# EAGLE design ShrewSpecs-1-2 (EAGLE 9.6.2)
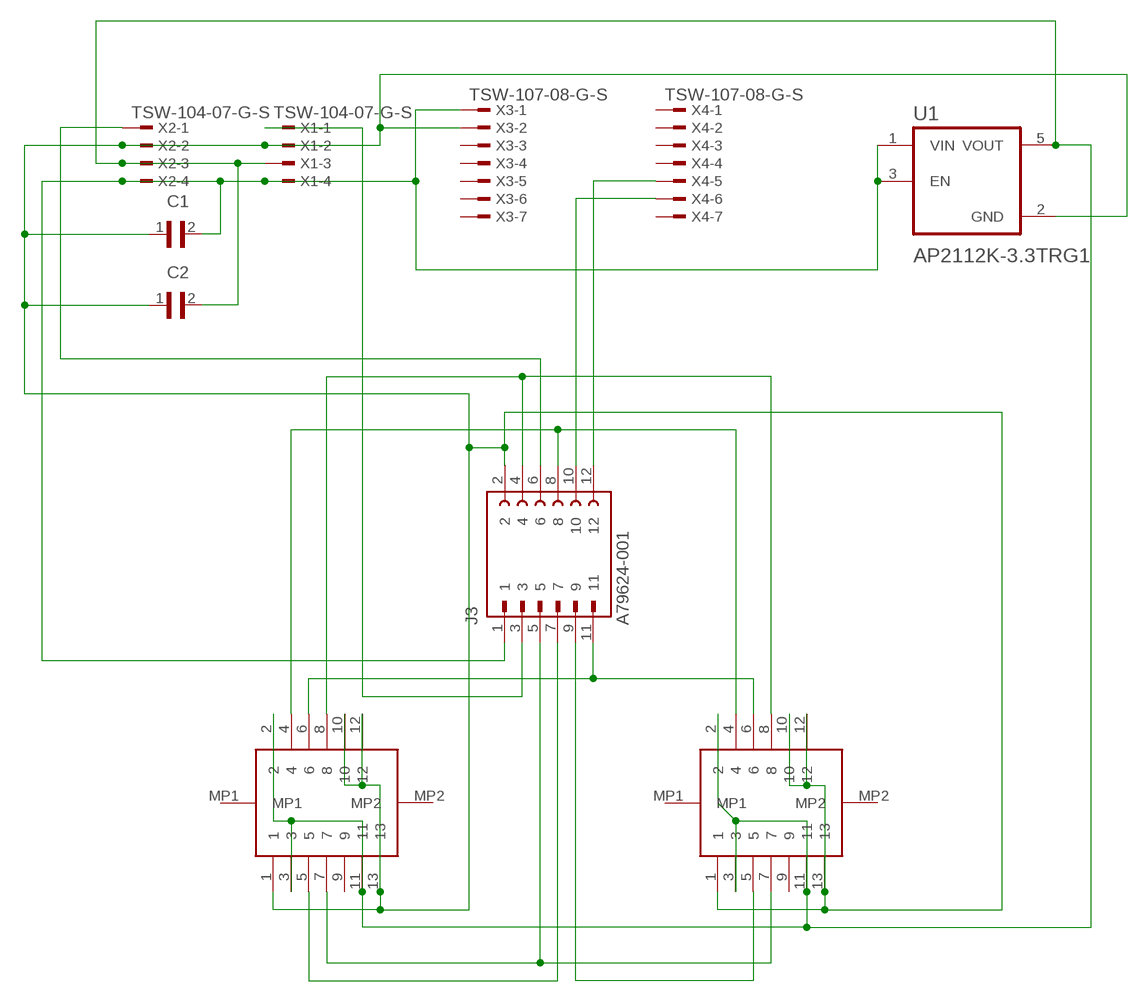
[diagram p0: schematic, sheet 1]

## Parts
C1  CL21A106KOQNNNE  [CAPC2012X140N]
C2  CL21A106KOQNNNE  [CAPC2012X140N]
J1  1-2328724-3  [123287243]
J2  1-2328724-3  [123287243]
J3  A79624-001  [OMNETICS_A79624-001]
U1  AP2112K-3.3TRG1  [SOT95P285X140-5N]
X1  TSW-104-07-G-S  [TSW-104-XX-G-S]
X2  TSW-104-07-G-S  [TSW-104-XX-G-S]
X3  TSW-107-08-G-S  [TSW-107-XX-G-S]
X4  TSW-107-08-G-S  [TSW-107-XX-G-S]

## Nets
N$1: C1.2 J3.1 U1.1(VIN) U1.3(EN) X1.4 X2.4 X3.1
N$2: J3.6 X2.1
N$3: C1.1 C2.1 J1.1 J1.10 J1.12 J1.13 J2.1 J2.10 J2.12 J2.13 J3.2 U1.2(GND) X1.2 X2.2 X3.2
N$4: J1.7 J2.7 J3.5
N$5: J1.5 J3.7
N$6: J2.5 J3.9
N$7: J1.6 J2.6 J3.11
N$8: J1.8 J2.8 J3.4
N$9: J1.4 J2.4 J3.8
N$10: J3.3 X1.1
N$11: J3.12 X4.5
N$12: J3.10 X4.6
N$14: C2.2 J1.2 J1.3 J1.11 J2.2 J2.3 J2.11 U1.5(VOUT) X1.3 X2.3
Unconnected: J1.9 J1.MP1 J1.MP2 J2.9 J2.MP1 J2.MP2 X3.3 X3.4 X3.5 X3.6 X3.7 X4.1 X4.2 X4.3 X4.4 X4.7

## Library data of the parts
C1 C2 = CL21A106KOQNNNE:CL21A106KOQNNNE; A_MAX: 1.4; A_MIN: 1.4; A_NOM: 1.4; D_MAX: 2.15; D_MIN: 1.85; D_NOM: 2.0; E_MAX: 1.4; E_MIN: 1.1; E_NOM: 1.25; L1_MAX: 0.7; L1_MIN: 0.2; L1_NOM: 0.5; L_MAX: 0.7; L_MIN: 0.2; L_NOM: 0.5; MANUFACTURER: Samsung Electro-Mechanics; STANDARD: IPC 7351B
J1 J2 = 1-2328724-3:1-2328724-3: AMP - TE CONNECTIVITY - 1-2328724-3 - CONNECTOR, FPC, R/A, 13POS, 1ROW, 0.3MM Source: Datasheet <https://www.te.com/commerce/DocumentDelivery/DDEController?Action=showdoc&DocId=Customer Drawing23287243pdfEnglishENG_CD_2328724_3.pdf1-2328724-3>; DESCRIPTION: AMP - TE CONNECTIVITY - 1-2328724-3 - CONNECTOR, FPC, R/A, 13POS, 1ROW, 0.3MM; HEIGHT: 1.1mm; MANUFACTURER_NAME: TE Connectivity; MANUFACTURER_PART_NUMBER: 1-2328724-3; MOUSER_PART_NUMBER: 571-1-2328724-3; MOUSER_PRICE-STOCK: https://www.mouser.co.uk/ProductDetail/TE-Connectivity/1-2328724-3?qs=w%2Fv1CP2dgqo8aBCjMy0R7g%3D%3D
J3 = A79624-001:A79624-001; CREATOR: DIZAR; MANUFACTURER: Omnetics; MAXIMUM_PACKAGE_HEIGHT: 4.826mm; PARTREV: E; STANDARD: Manufacturer Recommendations
U1 = AP2112K-3.3TRG1:AP2112K-3.3TRG1; MANUFACTURER: Diodes Inc.; PARTREV: 2-2
X1 X2 = con-samtec:TSW-104-*-G-S: THROUGH-HOLE .025" SQ POST HEADER Source: Samtec TSW.pdf; MF: Samtec Inc.; MPN: TSW-104-07-G-S
X3 X4 = con-samtec:TSW-107-*-G-S: THROUGH-HOLE .025" SQ POST HEADER Source: Samtec TSW.pdf; MF: Samtec Inc.; MPN: TSW-107-07-G-S

## Board
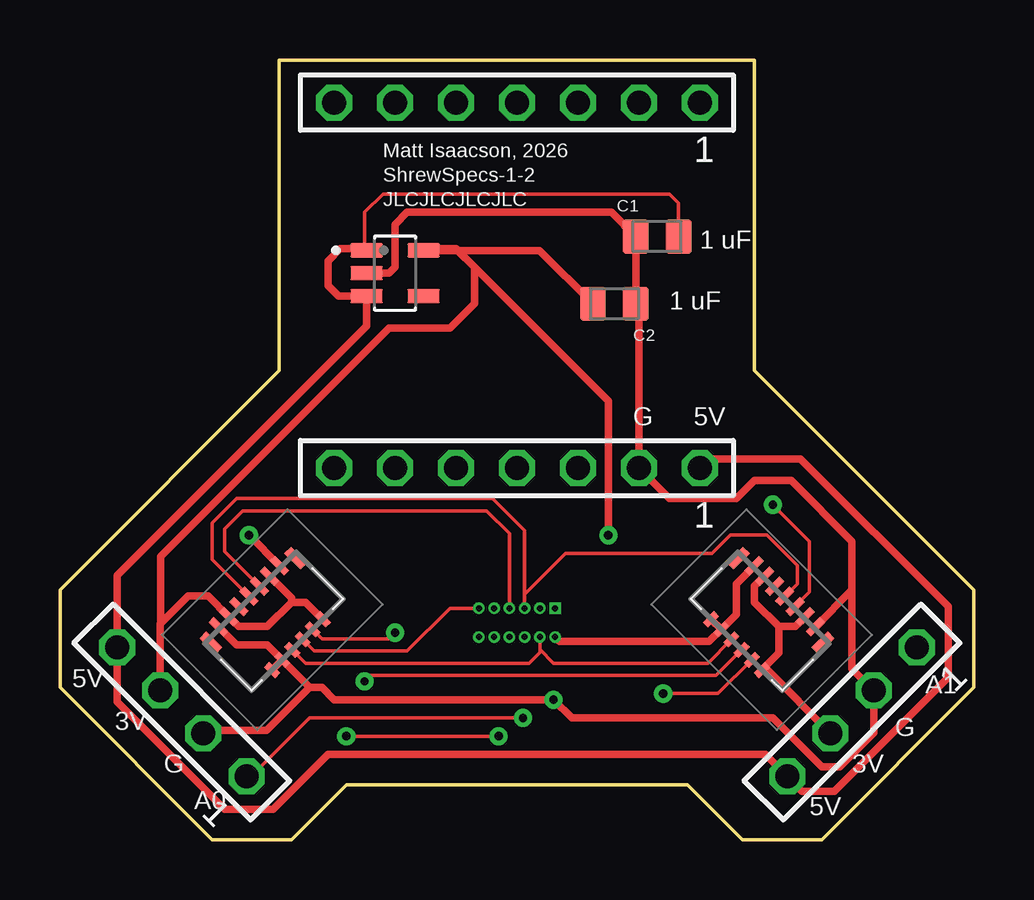
[diagram p1: board, top side]
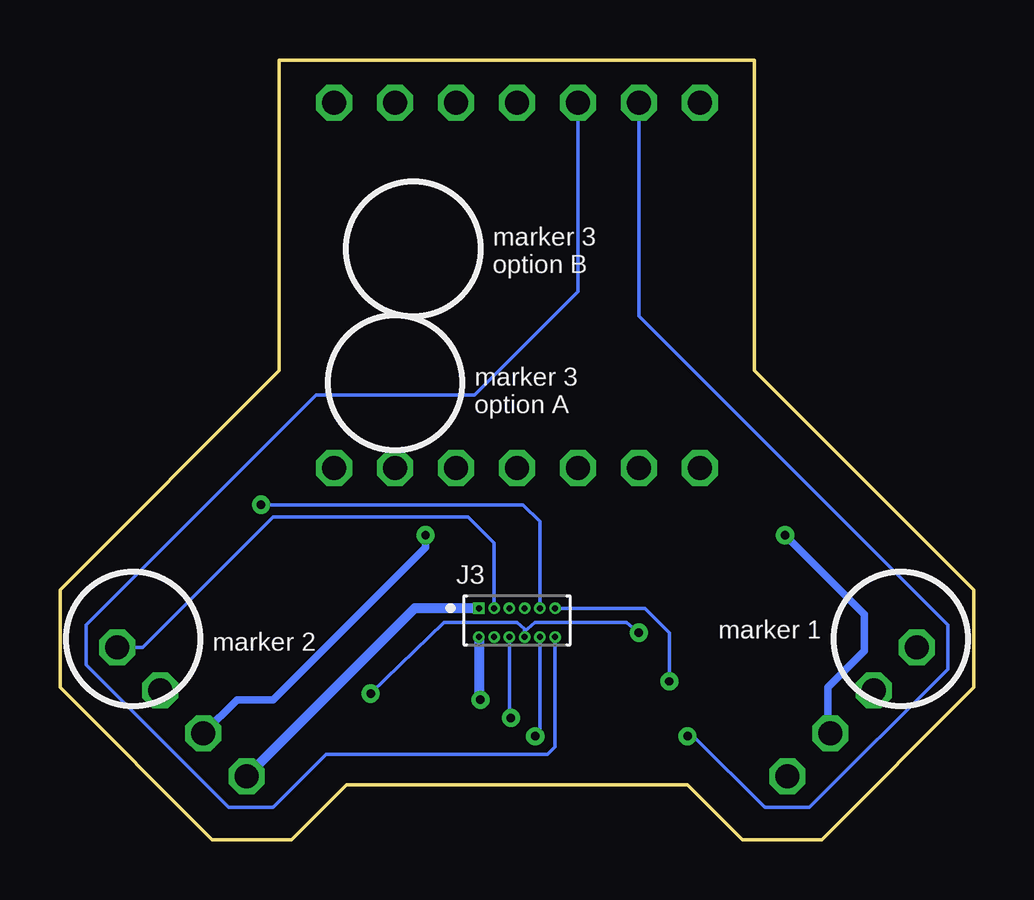
[diagram p2: board, bottom side, seen from below]

Size 38.1 x 32.51 mm. Coordinates in mm from the lower left corner, seen from the top.
Outline: 0,6.35 6.35,0 9.65,0 11.94,2.29 26.16,2.29 28.45,0 31.75,0 38.1,6.35 38.1,10.41 28.96,19.56 28.96,32.51 9.14,32.51 9.14,19.56 0,10.41 0,6.35
Copper layers (1*16): Top 0.035mm / dielectric 1.5mm / Bottom 0.035mm
Design rules "default *": minimum track width 6mil, minimum drill 0.25mm, track to track 6mil, track to pad 6mil, pad to pad 6mil, via to via 6mil, smd to smd 6mil, copper to edge 40mil, drill to drill 6mil, minimum pad ring 2mil, minimum via ring 8mil, stop-mask expansion 4mil, vias tented up to drill 0mil, thermal gap 10mil

### Footprints (pad centres in the part's own frame; a part is rotated, then mirrored left to right if it is on the bottom)
CAPC2012X140N = smd 1.08 x 1.42: 1 -0.895,0; 2 0.895,0
123287243 = smd 0.3 x 0.85: 1 -1.8,-1.425; 3 -1.2,-1.425; 5 -0.6,-1.425; 7 0,-1.425; 9 0.6,-1.425; 11 1.2,-1.425; 13 1.8,-1.425 | smd 0.3 x 0.65: 2 -1.5,1.425; 4 -0.9,1.425; 6 -0.3,1.425; 8 0.3,1.425; 10 0.9,1.425; 12 1.5,1.425 | smd 0.4 x 0.95: MP1 -2.5,-1.175; MP2 2.5,-1.175
OMNETICS_A79624-001 = drill 0.25 pad 0.483 square: 1 -1.587,0.508 | drill 0.25 pad 0.483: 2 -1.587,-0.686; 3 -0.953,0.508; 4 -0.953,-0.686; 5 -0.318,0.508; 6 -0.318,-0.686; 7 0.318,0.508; 8 0.318,-0.686; 9 0.953,0.508; 10 0.953,-0.686; 11 1.587,0.508; 12 1.587,-0.686
SOT95P285X140-5N = smd 1.35 x 0.6: 1 -1.185,0.95; 2 -1.185,0; 3 -1.185,-0.95; 4 1.185,-0.95; 5 1.185,0.95
TSW-104-XX-G-S = drill 1 pad 1.5 octagon: 1 3.81,0; 2 1.27,0; 3 -1.27,0; 4 -3.81,0
TSW-107-XX-G-S = drill 1 pad 1.5 octagon: 1 7.62,0; 2 5.08,0; 3 2.54,0; 4 0,0; 5 -2.54,0; 6 -5.08,0; 7 -7.62,0

### Placement (x,y rotation side)
C1  24.89,25.15 0 top
C2  23.11,22.35 180 top
J1  8.89,9.14 225 top
J2  29.21,9.14 135 top
J3  19.05,9.14 0 bottom
U1  13.97,23.62 0 top
X1  33.02,5.33 45 top
X2  5.08,5.33 315 top
X3  19.05,15.49 0 top
X4  19.05,30.73 0 top

### Tracks (layer width: path | path; a pad name or v marks a point on that pad's centre or on a via)
N$1
  Top 0.152: C1.2 25.79,26.54 25.4,26.92 13.46,26.92 12.7,26.16 12.7,24.66 12.72,24.64
  Top 0.305: U1.1 12.72,24.64 11.68,24.64 11.18,24.13 11.18,23.11 11.62,22.67 U1.3 12.79,21.42 2.39,11.02 X2.4 2.39,5.74 6.86,1.27 8.89,1.27 11.18,3.56 29.41,3.56 X1.4 30.93,2.03 32.28,2.03 37.02,6.78 37.02,9.73 30.87,15.88 27.06,15.88 X3.1
  Bottom 0.406: J3.1 23.31,9.65 X1.4
N$2  (via drill 0.35)
  Top 0.152: v19.3,5.08 10.41,5.08 7.97,2.64 X2.1
  Bottom 0.152: J3.6 19.37,5.14 v19.3,5.08
N$3  (via drill 0.35)
  Top 0.152: J1.10
  Top 0.305: J1.12 J1.10 10.41,6.35 | J1.13 7.36,8.13 8.64,8.13 J1.10 | X2.2 6.11,4.56 8.62,4.56 10.41,6.35 | J1.1 v7.88,12.7 v7.87,12.7 | J2.10 28.19,9.4 28.19,10.67 J2.13 | J2.10 J2.12 | J2.10 27.06,8.26 20.83,8.26 J3.2 | 33.02,10.41 33.02,12.45 30.48,14.99 28.96,14.99 28.19,14.22 25.4,14.22 X3.2 24.13,22.23 C2.1 C1.1 22.98,26.16 14.48,26.16 13.97,25.65 13.97,23.88 13.72,23.62 U1.2 | 33.02,10.41 J2.1 | 33.02,10.41 33.02,7.13 X1.2 33.92,4.45 32.51,3.05 31.75,3.05 29.72,5.08 21.34,5.08 v20.57,5.84 11.43,5.84 10.92,6.35 10.41,6.35
  Bottom 0.152: 6.1,4.55 X2.2 | 20.64,5.91 v20.57,5.84
  Bottom 0.305: v7.87,12.7 4.57,9.4 4.57,7.87 6.1,6.35 6.1,4.55
  Bottom 0.406: J3.2 20.64,5.91
N$4
  Top 0.152: J1.7 6.35,11.68 6.35,13.21 7.37,14.22 18.03,14.22 19.37,12.89 J3.5 19.37,10.22 21.08,11.94 27.18,11.94 27.94,12.7 29.46,12.7 30.73,11.43 30.73,10.67 J2.7
N$5
  Top 0.152: J1.5 6.86,12.03 6.86,12.95 7.62,13.72 17.78,13.72 18.73,12.76 J3.7
N$6  (via drill 0.35)
  Top 0.152: J2.5 31.24,10.33 31.24,12.45 v29.72,13.97
  Bottom 0.152: v29.72,13.97 18.8,13.97 18.1,13.27 J3.9
N$7  (via drill 0.35)
  Top 0.152: J1.6 10.58,7.87 14.48,7.87 16.26,9.65 J3.11 | v12.7,6.6 12.95,6.86 27.35,6.86 J2.6
  Bottom 0.152: v12.7,6.6 12.7,8.64 13.72,9.65 J3.11
N$8
  Top 0.152: J1.8 10.24,7.37 19.56,7.37 20,7.81 J3.4 20,7.94 20.57,7.37 27.01,7.37 J2.8
N$9  (via drill 0.35)
  Top 0.152: J1.4 10.93,8.38 13.72,8.38 v13.97,8.64 | v25.15,6.1 27.43,6.1 J2.4
  Bottom 0.152: v13.97,8.64 14.48,9.07 18.29,9.07 18.73,8.7 J3.8 18.73,8.79 19.05,9.07 22.1,9.07 v25.15,6.1
N$10
  Bottom 0.152: X1.1 34.64,8.03 29.21,13.46 21.08,13.46 20,12.38 J3.3
N$11
  Bottom 0.152: X4.5 16.51,22.86 20.83,18.54 27.43,18.54 37.01,8.97 37.01,7.29 31.06,1.35 29.21,1.35 27,3.56 17.78,3.56 17.46,3.87 J3.12
N$12  (via drill 0.35)
  Top 0.152: v11.94,4.32 v18.29,4.32
  Bottom 0.152: X4.6 13.97,21.84 1.09,8.97 1.09,7.11 6.86,1.35 8.71,1.35 11.68,4.32 v11.94,4.32 | J3.10 18.1,4.51 v18.29,4.32
N$14  (via drill 0.35)
  Top 0.152: J2.2 29.48,7.08
  Top 0.305: 4.19,9.02 5.33,10.16 6.18,10.16 J1.11 7.45,8.89 8.64,8.89 9.65,9.91 | 4.19,9.02 4.18,9.01 X2.3 | J1.3 9.65,10.08 9.65,9.91 | 9.65,9.91 10.25,9.91 J1.2 | J2.3 30.65,8.89 29.97,8.89 | 29.97,8.89 28.96,9.91 28.96,10.59 J2.11 | J2.2 29.97,7.79 29.97,8.89 | 4.19,9.02 4.19,11.81 13.72,21.34 16.26,21.34 17.27,22.35 17.27,23.88 16.58,24.57 | 16.58,24.57 15.75,24.57 | 15.75,24.57 U1.5 | 29.48,7.08 X1.3 | 15.75,24.57 15.81,24.64 16.51,24.64 22.86,18.29 v22.86,12.7 | C2.2 20,24.57 16.58,24.57
  Bottom 0.305: X1.3 30.72,5.84 29.21,5.84 22.86,12.19 v22.86,12.7

### Text on the board
tNames: Matt Isaacson, 2026 | ShrewSpecs-1-2 | JLCJLCJLCJLC | 1 uF | 1 uF | G | 5V | 5V | A1 | 3V | G | G | 3V | A0 | 5V
bNames: marker 3 / option B | marker 3 / option A | marker 1 | marker 2